# EAGLE design Enclosure.Back (EAGLE 7.6.0)
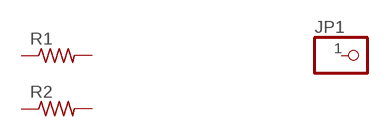
[diagram p0: schematic, sheet 1]

## Parts
JP1  PINHD-1X1  [1X01]
R1  R-US_R0805  [R0805]
R2  R-US_R0805  [R0805]
Unconnected: JP1.1 R1.1 R1.2 R2.1 R2.2

## Library data of the parts
JP1 = adafruit:PINHD-1X1: Pin header 1x1 for 0.1" spacing With round pins
R1 R2 = adafruit:R-US_: RESISTOR, American symbol

## Board
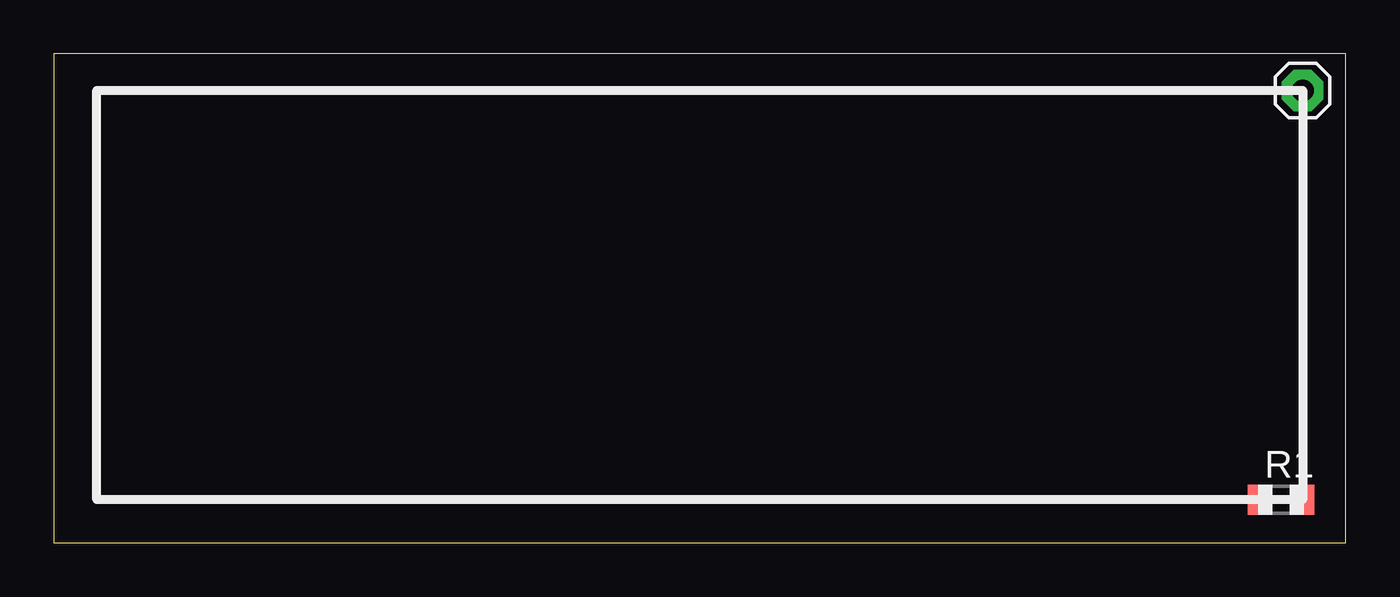
[diagram p1: board, top side]
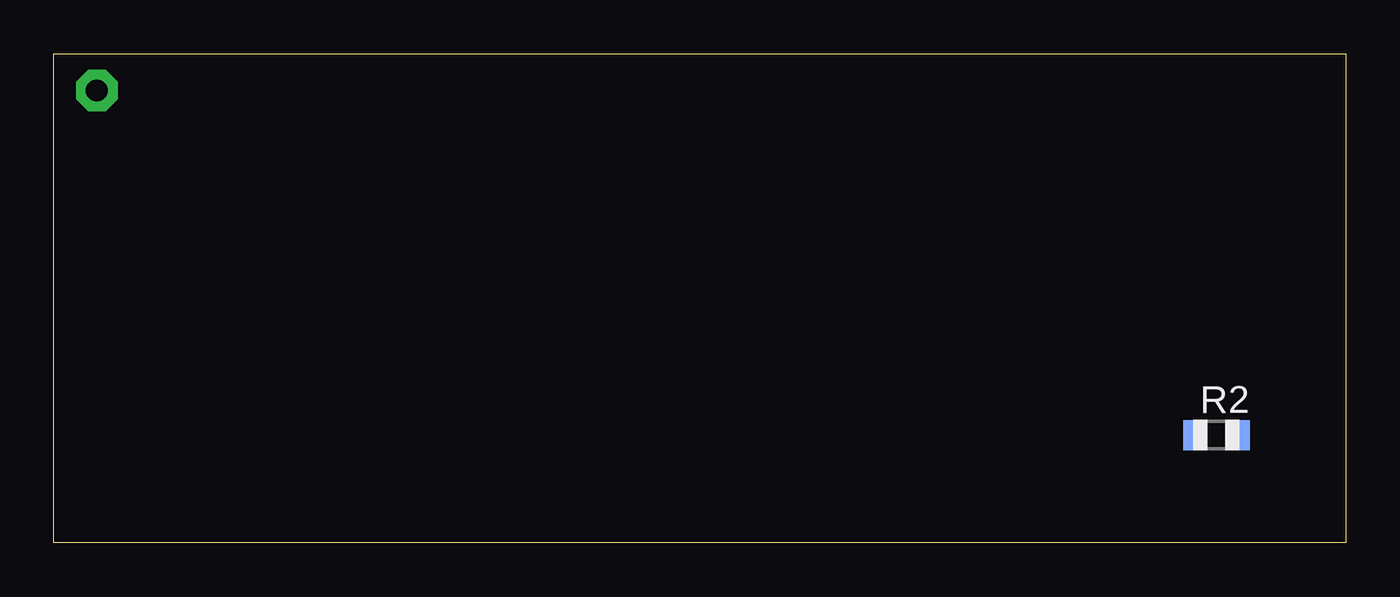
[diagram p2: board, bottom side, seen from below]

Size 60 x 22.7 mm. Coordinates in mm from the lower left corner, seen from the top.
Outline: 0,0 60,0 60,22.7 0,22.7 0,0
Copper layers (1*16): Top 0.035mm / dielectric 1.5mm / Bottom 0.035mm
Design rules "default": minimum track width 10mil, minimum drill 24mil, track to track 8mil, track to pad 8mil, pad to pad 8mil, via to via 8mil, smd to smd 8mil, copper to edge 40mil, drill to drill 8mil, minimum pad ring 10mil, minimum via ring 8mil, stop-mask expansion 4mil, vias tented up to drill 0mil, thermal gap 10mil

### Footprints (pad centres in the part's own frame; a part is rotated, then mirrored left to right if it is on the bottom)
1X01 = drill 1.016 pad 1.93 octagon: 1 0,0
R0805 = smd 1.1 x 1.4: 1 -1,0; 2 1,0

### Placement (x,y rotation side)
JP1  58,21 0 top
R1  57,2 0 top
R2  6,5 0 bottom

### Tracks (layer width: path | path; a pad name or v marks a point on that pad's centre or on a via)
N$1
  cutout Top: 20.5,15.5 37.5,15.5 37.5,7.5 20.5,7.5